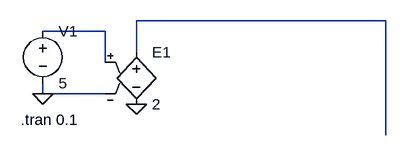
[diagram p0: schematic Draft7.asc]
Draft7.asc, the LTspice schematic file:
Version 4
SHEET 1 880 680
WIRE 528 16 144 16
WIRE 96 32 0 32
WIRE 144 64 144 16
WIRE 96 80 96 32
WIRE 0 128 0 112
WIRE 96 128 0 128
WIRE 528 192 528 16
FLAG 144 144 0
FLAG 0 128 0
SYMBOL e 144 48 R0
SYMATTR InstName E1
SYMATTR Value 2
SYMBOL voltage 0 16 R0
WINDOW 123 0 0 Left 2
WINDOW 39 0 0 Left 2
SYMATTR InstName V1
SYMATTR Value 5
TEXT -34 168 Left 2 !.tran 0.1

The netlist it stands for:
* Draft7.asc
E1 N001 0 N002 0 2
V1 N002 0 5
.tran 0.1
.backanno
.end